# Altium project My_MucLeo_EXT_Board.PrjPCB
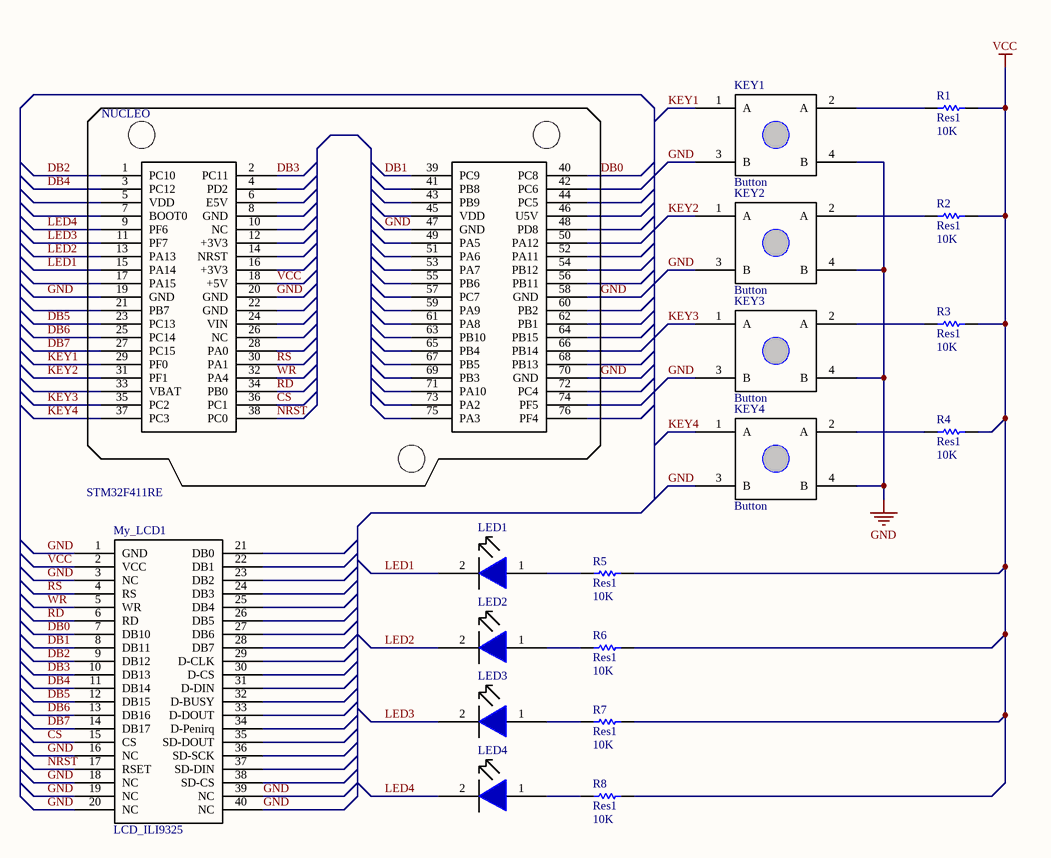
[diagram p0: My_MucLeo_EXT_Board.SchDoc]
1 sheet, 18 parts. Net scope: global (net labels, ports and power ports of the same name join across sheets).
Board file: My_MucLeo_EXT_Board.PcbDoc

## Sheet My_MucLeo_EXT_Board.SchDoc
size A4

### Parts
KEY1  Button  [My_Button]
KEY2  Button  [My_Button]
KEY3  Button  [My_Button]
KEY4  Button  [My_Button]
LED1  LED  [LED-F5]  (value not drawn)
LED2  LED  [LED-F5]  (value not drawn)
LED3  LED  [LED-F5]  (value not drawn)
LED4  LED  [LED-F5]  (value not drawn)
My_LCD1  LCD_ILI9325  [ILI9325]
NUCLEO  STM32F411RE  [NUCLEO Board]
R1  Res1  value 10K  [6-0805_N]
R2  Res1  value 10K  [6-0805_N]
R3  Res1  value 10K  [6-0805_N]
R4  Res1  value 10K  [6-0805_N]
R5  Res1  value 10K  [6-0805_N]
R6  Res1  value 10K  [6-0805_N]
R7  Res1  value 10K  [6-0805_N]
R8  Res1  value 10K  [6-0805_N]

### Nets
GND: KEY1.3(B) KEY1.4(B) KEY2.3(B) KEY2.4(B) KEY3.3(B) KEY3.4(B) KEY4.3(B) KEY4.4(B) My_LCD1.1(GND) My_LCD1.3(NC) My_LCD1.16(NC) My_LCD1.18(NC) My_LCD1.19(NC) My_LCD1.20(NC) My_LCD1.39(NC) My_LCD1.40(NC) NUCLEO.19(GND) NUCLEO.20(GND) NUCLEO.47(GND) NUCLEO.58(GND) NUCLEO.70(GND)
VCC: My_LCD1.2(VCC) NUCLEO.18(+5V) R1.1 R2.1 R3.1 R4.1 R5.1 R6.1 R7.1 R8.1
CS: My_LCD1.15(CS) NUCLEO.36(PC1)
DB0: My_LCD1.7(DB10) NUCLEO.40(PC8)
DB1: My_LCD1.8(DB11) NUCLEO.39(PC9)
DB2: My_LCD1.9(DB12) NUCLEO.1(PC10)
DB3: My_LCD1.10(DB13) NUCLEO.2(PC11)
DB4: My_LCD1.11(DB14) NUCLEO.3(PC12)
DB5: My_LCD1.12(DB15) NUCLEO.23(PC13)
DB6: My_LCD1.13(DB16) NUCLEO.25(PC14)
DB7: My_LCD1.14(DB17) NUCLEO.27(PC15)
KEY1: KEY1.1(A) NUCLEO.29(PF0)
KEY2: KEY2.1(A) NUCLEO.31(PF1)
KEY3: KEY3.1(A) NUCLEO.35(PC2)
KEY4: KEY4.1(A) NUCLEO.37(PC3)
LED1: LED1.2 NUCLEO.15(PA14)
LED2: LED2.2 NUCLEO.13(PA13)
LED3: LED3.2 NUCLEO.11(PF7)
LED4: LED4.2 NUCLEO.9(PF6)
NRST: My_LCD1.17(RSET) NUCLEO.38(PC0)
RD: My_LCD1.6(RD) NUCLEO.34(PB0)
RS: My_LCD1.4(RS) NUCLEO.30(PA1)
WR: My_LCD1.5(WR) NUCLEO.32(PA4)
NetKEY1_2: KEY1.2(A) R1.2
NetKEY2_2: KEY2.2(A) R2.2
NetKEY3_2: KEY3.2(A) R3.2
NetKEY4_2: KEY4.2(A) R4.2
NetLED1_1: LED1.1 R5.2
NetLED2_1: LED2.1 R6.2
NetLED3_1: LED3.1 R7.2
NetLED4_1: LED4.1 R8.2

Not connected (* = marked no-connect by the designer): My_LCD1 21(DB0) 22(DB1) 23(DB2) 24(DB3) 25(DB4) 26(DB5) 27(DB6) 28(DB7) 29(D-CLK) 30(D-CS) 31(D-DIN) 32(D-BUSY) 33(D-DOUT) 34(D-Penirq) 35(SD-DOUT) 36(SD-SCK) 37(SD-DIN) 38(SD-CS); NUCLEO 4(PD2) 5(VDD) 6(E5V) 7(BOOT0) 8(GND) 10(NC) 12(+3V3) 14(NRST) 16(+3V3) 17(PA15) 21(PB7) 22(GND) 24(VIN) 26(NC) 28(PA0) 33(VBAT) 41(PB8) 42(PC6) 43(PB9) 44(PC5) 45(VDD) 46(U5V) 48(PD8) 49(PA5) 50(PA12) 51(PA6) 52(PA11) 53(PA7) 54(PB12) 55(PB6) 56(PB11) 57(PC7) 59(PA9) 60(PB2) 61(PA8) 62(PB1) 63(PB10) 64(PB15) 65(PB4) 66(PB14) 67(PB5) 68(PB13) 69(PB3) 71(PA10) 72(PC4) 73(PA2) 74(PF5) 75(PA3) 76(PF4)

### Library data of the parts
KEY1-KEY4 = My_Button: My Button
LED1-LED4 = LED: My LED
NUCLEO = NUCLEO: STM32F411RE Nucleo Board
R1-R8 = Res1: Resistor; Published: 8-Jun-2000; LatestRevisionDate: 17-Jul-2002; LatestRevisionNote: Re-released for DXP Platform.; PackageReference: AXIAL-0.3; Publisher: Altium Limited; PackageDescription: Axial Device, Thru-Hole; 2 Leads; 0.3 in Pin Spacing